# Altium schematic sheet mwh618.schdoc: MWH618
size A4; Date: 02.10.2025; CheckedBy: BCY; DrawnBy: miaow; Revision: v1.0.0; SheetNumber: 1; SheetTotal: 18; BoardType: MAIN_PCB; Desc: miaow's h618 linux development board
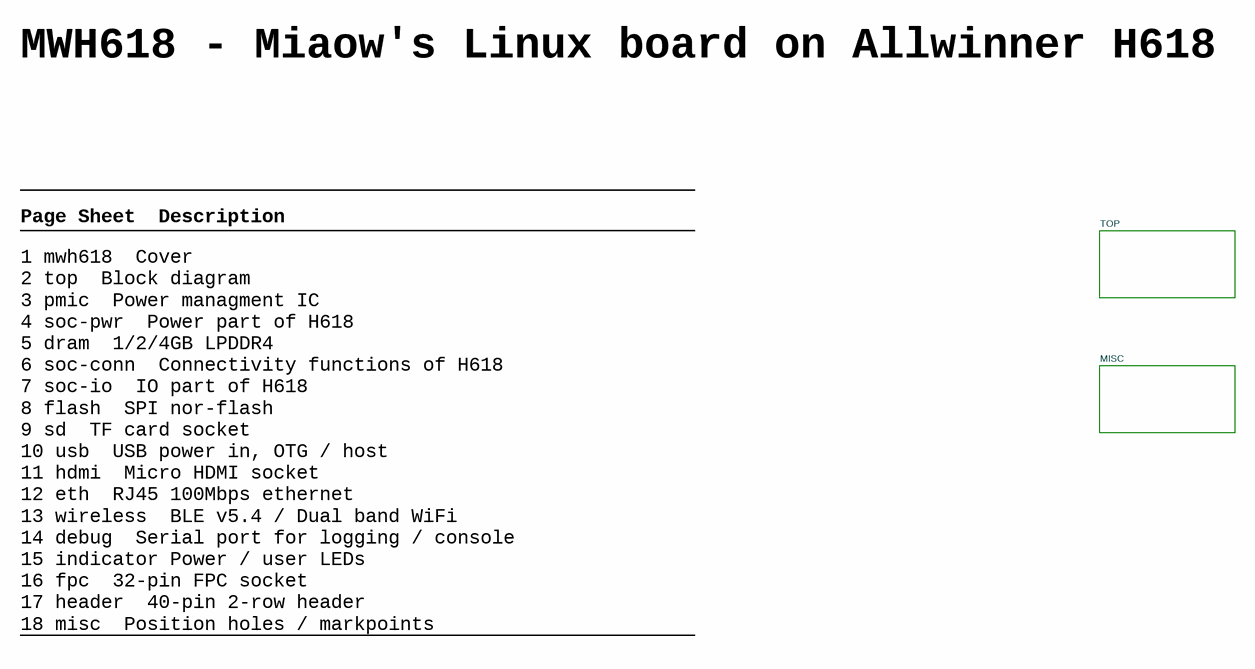
[diagram p0: mwh618.schdoc]

## Sub-sheets
MISC = misc.schdoc: no entries
TOP = top.schdoc: no entries

## Notes on the sheet
- MWH618 - Miaow's Linux board on Allwinner H618
- Page	Sheet		Description
- 1	mwh618		Cover
  2	top		Block diagram
  3	pmic		Power managment IC
  4	soc-pwr		Power part of H618
  5	dram		1/2/4GB LPDDR4
  6	soc-conn		Connectivity functions of H618
  7	soc-io		IO part of H618
  8	flash		SPI nor-flash
  9	sd		TF card socket
  10	usb		USB power in, OTG / host
  11	hdmi		Micro HDMI socket
  12	eth		RJ45 100Mbps ethernet
  13	wireless		BLE v5.4 / Dual band WiFi
  14	debug		Serial port for logging / console
  15	indicator	Power / user LEDs
  16	fpc		32-pin FPC socket
  17	header		40-pin 2-row header
  18	misc		Position holes / markpoints
- DRAWN
- CHECKED
- DRAWNBY
- SHEETS
- SHEETS_NO